# EAGLE design LT3060XDC_45V_to_1V8 (EAGLE 7.2.0)
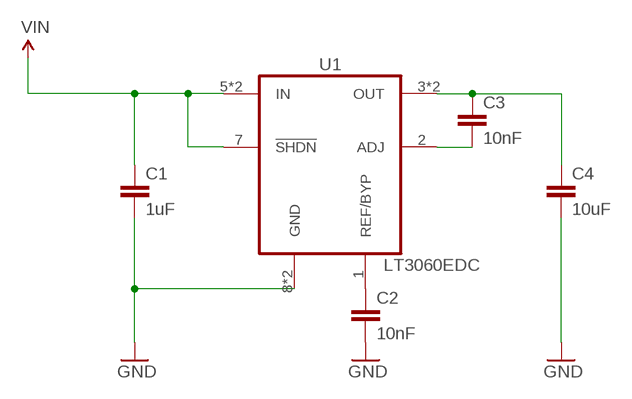
[diagram p0: schematic, sheet 1]

## Parts
C1  1uF  C-EUC0402  [C0402]
C2  10nF  C-EUC0402  [C0402]
C3  10nF  C-EUC0402  [C0402]
C4  10uF  C-EUC0402  [C0402]
U1  LT3060EDC  [LINEAR_DC8]

## Nets
GND: C1.2 C2.2 C4.2 U1.8(GND) U1.9(GND)
N$4: C3.2 U1.2(ADJ)
N$6: C2.1 U1.1(REF/BYP)
OUT: C3.1 C4.1 U1.3(OUT) U1.4(OUT)
VIN: C1.1 U1.5(IN) U1.6(IN) U1.7(!SHDN)

## Library data of the parts
C1-C4 = rcl:C-EU: CAPACITOR, European symbol
U1 = 1V8:LT3060

## Board
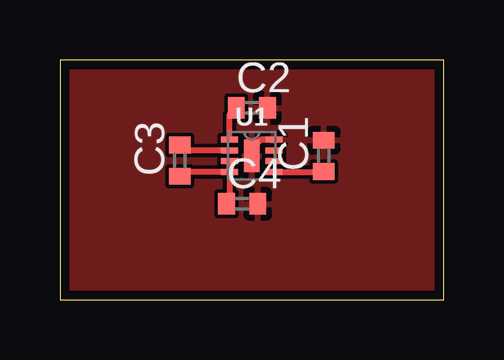
[diagram p1: board, top side]

Size 16 x 10 mm. Coordinates in mm from the lower left corner, seen from the top.
Outline: 0,0 16,0 16,10 0,10 0,0
Copper layers (1*16): Top 0.0356mm / dielectric 1.5011mm / Bottom 0.0356mm
Design rules "oshpark-2layer": minimum track width 6mil, minimum drill 13mil, track to track 6mil, track to pad 6mil, pad to pad 6mil, via to via 6mil, smd to smd 6mil, copper to edge 15mil, drill to drill 6mil, minimum pad ring 7mil, minimum via ring 7mil, stop-mask expansion 4mil, vias tented up to drill 0mil, thermal gap 10mil

### Footprints (pad centres in the part's own frame; a part is rotated, then mirrored left to right if it is on the bottom)
C0402 = smd 0.7 x 0.9: 1 -0.65,0; 2 0.65,0
LINEAR_DC8 = smd 0.7 x 0.25: 1 -0.925,0.675; 2 -0.925,0.225; 3 -0.925,-0.225; 4 -0.925,-0.675; 5 0.925,-0.675; 6 0.925,-0.225; 7 0.925,0.225; 8 0.925,0.675 | smd 0.64 x 1.37: 9 0,0

### Placement (x,y rotation side)
C1  11,6 90 top
C2  8,8 0 top
C3  5,5.8 90 top
C4  7.6,4 0 top
U1  8,6 0 top

### Tracks (layer width: path | path; a pad name or v marks a point on that pad's centre or on a via)
GND
  Top 0.254: 8.93,7.72 C2.2 | U1.8 8.38,6.67 8,6.3 U1.9
  pour Top: 0,10 16,10 16,0 0,0
N$4
  Top 0.254: U1.2 5.22,6.22 C3.2
N$6
  Top 0.254: U1.1 7.07,7.72 C2.1
OUT
  Top 0.254: U1.4 7.07,4.12 C4.1 | U1.4 5.18,5.33 C3.1 | U1.4 U1.3
VIN  (2 unrouted)
  Top 0.254: U1.5 10.97,5.33 C1.1